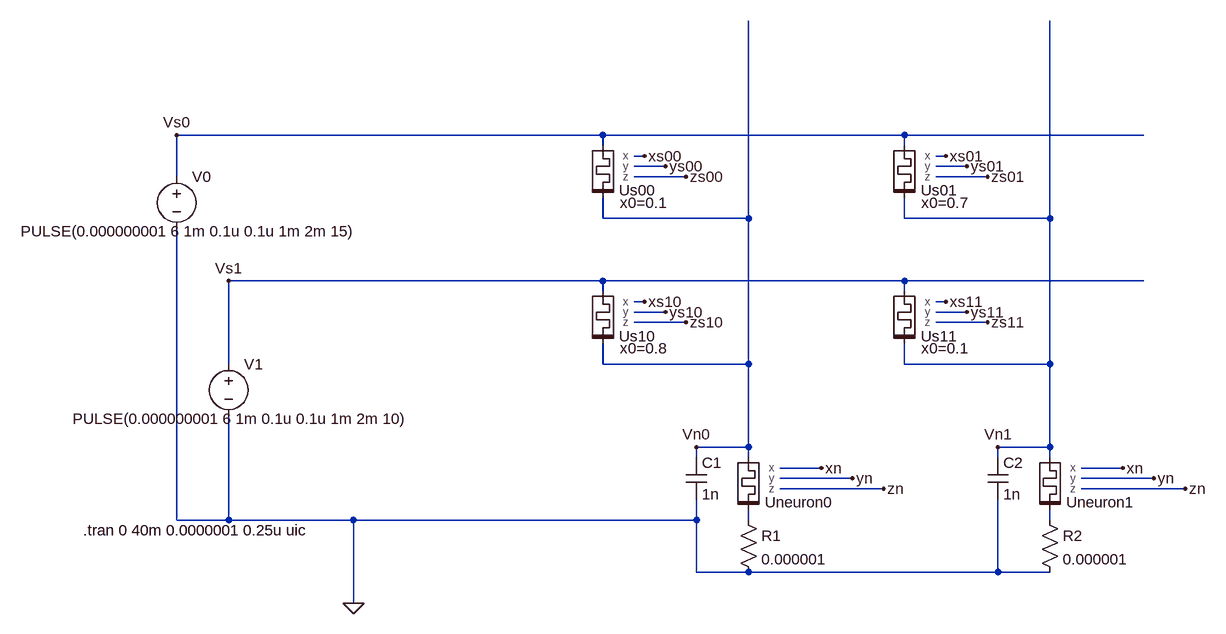
[diagram p0: schematic 4s2n.asc]
4s2n.asc, the LTspice schematic file:
Version 4
SHEET 1 880 680
WIRE -960 -800 -1616 -800
WIRE -496 -800 -960 -800
WIRE -128 -800 -496 -800
WIRE -960 -784 -960 -800
WIRE -496 -784 -496 -800
WIRE -896 -768 -912 -768
WIRE -432 -768 -448 -768
WIRE -864 -752 -912 -752
WIRE -400 -752 -448 -752
WIRE -1616 -736 -1616 -800
WIRE -832 -736 -912 -736
WIRE -368 -736 -448 -736
WIRE -960 -672 -960 -704
WIRE -736 -672 -736 -976
WIRE -736 -672 -960 -672
WIRE -496 -672 -496 -704
WIRE -272 -672 -272 -976
WIRE -272 -672 -496 -672
WIRE -960 -576 -1536 -576
WIRE -496 -576 -960 -576
WIRE -128 -576 -496 -576
WIRE -960 -560 -960 -576
WIRE -496 -560 -496 -576
WIRE -896 -544 -912 -544
WIRE -432 -544 -448 -544
WIRE -864 -528 -912 -528
WIRE -400 -528 -448 -528
WIRE -832 -512 -912 -512
WIRE -368 -512 -448 -512
WIRE -1536 -448 -1536 -576
WIRE -960 -448 -960 -480
WIRE -736 -448 -736 -672
WIRE -736 -448 -960 -448
WIRE -496 -448 -496 -480
WIRE -272 -448 -272 -672
WIRE -272 -448 -496 -448
WIRE -736 -320 -736 -448
WIRE -736 -320 -816 -320
WIRE -272 -320 -272 -448
WIRE -272 -320 -352 -320
WIRE -816 -304 -816 -320
WIRE -736 -304 -736 -320
WIRE -352 -304 -352 -320
WIRE -272 -304 -272 -320
WIRE -624 -288 -688 -288
WIRE -160 -288 -224 -288
WIRE -576 -272 -688 -272
WIRE -112 -272 -224 -272
WIRE -528 -256 -688 -256
WIRE -64 -256 -224 -256
WIRE -1616 -208 -1616 -656
WIRE -1536 -208 -1536 -368
WIRE -1536 -208 -1616 -208
WIRE -1344 -208 -1536 -208
WIRE -816 -208 -816 -240
WIRE -816 -208 -1344 -208
WIRE -736 -208 -736 -224
WIRE -272 -208 -272 -224
WIRE -816 -128 -816 -208
WIRE -736 -128 -816 -128
WIRE -352 -128 -352 -240
WIRE -352 -128 -736 -128
WIRE -272 -128 -352 -128
WIRE -1344 -80 -1344 -208
FLAG -1344 -80 0
FLAG -896 -768 xs00
FLAG -864 -752 ys00
FLAG -832 -736 zs00
FLAG -1616 -800 Vs0
FLAG -624 -288 xn
FLAG -576 -272 yn
FLAG -528 -256 zn
FLAG -816 -320 Vn0
FLAG -432 -768 xs01
FLAG -400 -752 ys01
FLAG -368 -736 zs01
FLAG -896 -544 xs10
FLAG -864 -528 ys10
FLAG -832 -512 zs10
FLAG -432 -544 xs11
FLAG -400 -528 ys11
FLAG -368 -512 zs11
FLAG -160 -288 xn
FLAG -112 -272 yn
FLAG -64 -256 zn
FLAG -352 -320 Vn1
FLAG -1536 -576 Vs1
SYMBOL voltage -1616 -752 R0
WINDOW 123 0 0 Left 0
WINDOW 39 0 0 Left 0
WINDOW 3 -240 100 Left 2
SYMATTR Value PULSE(0.000000001 6 1m 0.1u 0.1u 1m 2m 15)
SYMATTR InstName V0
SYMBOL cap -832 -304 R0
SYMATTR InstName C1
SYMATTR Value 1n
SYMBOL memristor_neuron -752 -320 R0
SYMATTR InstName Uneuron0
SYMBOL memristor_synapse -976 -800 R0
SYMATTR InstName Us00
SYMATTR Value x0=0.1
SYMBOL memristor_synapse -512 -800 R0
SYMATTR InstName Us01
SYMATTR Value x0=0.7
SYMBOL memristor_synapse -512 -576 R0
SYMATTR InstName Us11
SYMATTR Value x0=0.1
SYMBOL memristor_synapse -976 -576 R0
SYMATTR InstName Us10
SYMATTR Value x0=0.8
SYMBOL cap -368 -304 R0
SYMATTR InstName C2
SYMATTR Value 1n
SYMBOL memristor_neuron -288 -320 R0
SYMATTR InstName Uneuron1
SYMBOL voltage -1536 -464 R0
WINDOW 123 0 0 Left 0
WINDOW 39 0 0 Left 0
WINDOW 3 -240 100 Left 2
SYMATTR Value PULSE(0.000000001 6 1m 0.1u 0.1u 1m 2m 10)
SYMATTR InstName V1
SYMBOL res -288 -224 R0
SYMATTR InstName R2
SYMATTR Value 0.000001
SYMBOL res -752 -224 R0
SYMATTR InstName R1
SYMATTR Value 0.000001
TEXT -1760 -192 Left 2 !.tran 0 40m 0.0000001 0.25u uic

The netlist it stands for:
* 4s2n.asc
V0 Vs0 0 PULSE(0.000000001 6 1m 0.1u 0.1u 1m 2m 15)
C1 Vn0 0 1n
XUneuron0 Vn0 N001 xn yn zn memristor_neuron  ; pins plus minus x y z
XUs00 Vs0 Vn0 xs00 ys00 zs00 memristor_synapse x0=0.1  ; pins plus minus x y z
XUs01 Vs0 Vn1 xs01 ys01 zs01 memristor_synapse x0=0.7  ; pins plus minus x y z
XUs11 Vs1 Vn1 xs11 ys11 zs11 memristor_synapse x0=0.1  ; pins plus minus x y z
XUs10 Vs1 Vn0 xs10 ys10 zs10 memristor_synapse x0=0.8  ; pins plus minus x y z
C2 Vn1 0 1n
XUneuron1 Vn1 N002 xn yn zn memristor_neuron  ; pins plus minus x y z
V1 Vs1 0 PULSE(0.000000001 6 1m 0.1u 0.1u 1m 2m 10)
R2 N002 0 0.000001
R1 N001 0 0.000001
.tran 0 40m 0.0000001 0.25u uic
.lib memristor_neuron.sub
.lib memristor_synapse.sub
.backanno
.end